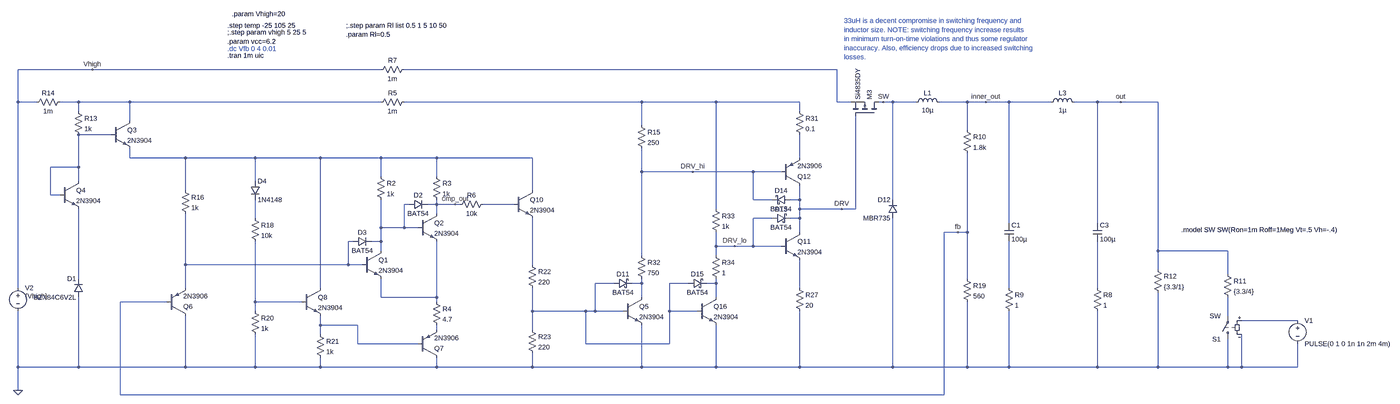
[diagram p0: schematic hyst_voltage_regulator2.asc, whole sheet]
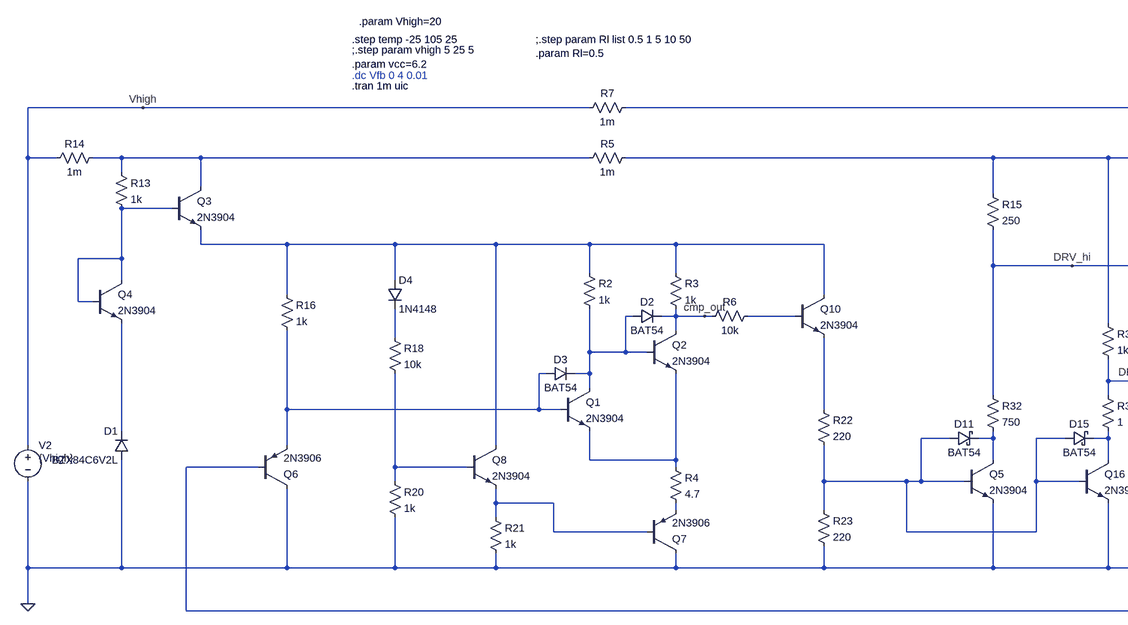
[diagram p1: schematic hyst_voltage_regulator2.asc, part, row 1 of 1, column 1 of 2]
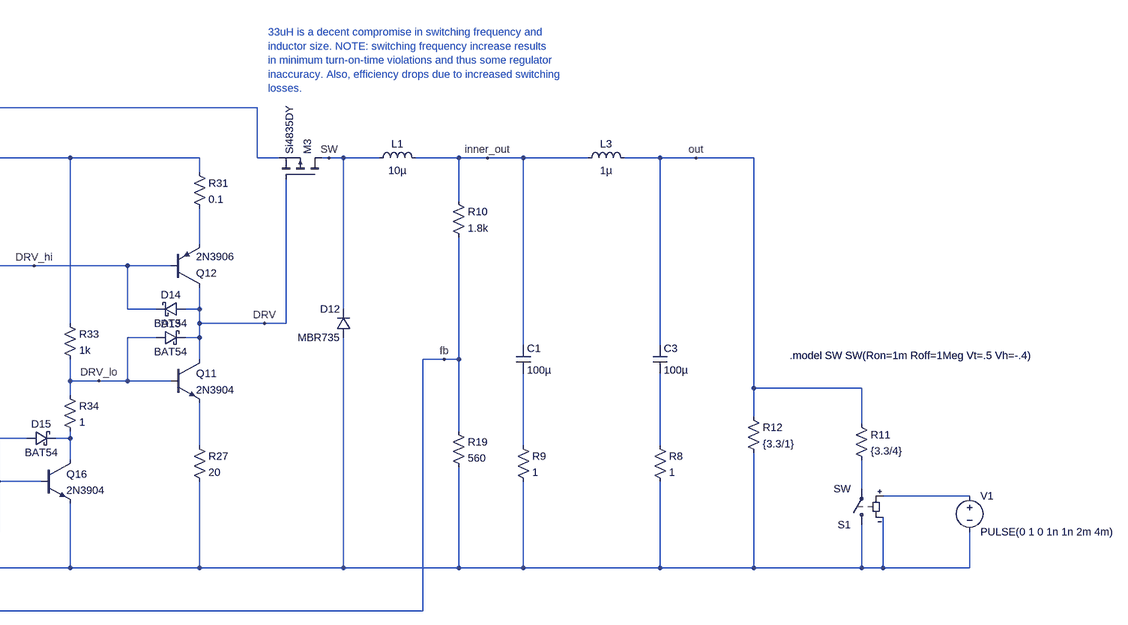
[diagram p2: schematic hyst_voltage_regulator2.asc, part, row 1 of 1, column 2 of 2]
hyst_voltage_regulator2.asc, the LTspice schematic file:
Version 4.1
SHEET 1 5252 3804
WIRE -784 -544 -1040 -544
WIRE 208 -544 -784 -544
WIRE 2000 -544 288 -544
WIRE -1040 -432 -1040 -544
WIRE -976 -432 -1040 -432
WIRE -832 -432 -896 -432
WIRE -656 -432 -832 -432
WIRE 208 -432 -656 -432
WIRE 1328 -432 288 -432
WIRE 1584 -432 1328 -432
WIRE 1872 -432 1584 -432
WIRE 2000 -432 2000 -544
WIRE 2048 -432 2000 -432
WIRE 2160 -432 2144 -432
WIRE 2192 -432 2160 -432
WIRE 2272 -432 2192 -432
WIRE 2448 -432 2352 -432
WIRE 2512 -432 2448 -432
WIRE 2592 -432 2512 -432
WIRE 2736 -432 2592 -432
WIRE 2896 -432 2816 -432
WIRE 2976 -432 2896 -432
WIRE 3104 -432 2976 -432
WIRE -832 -400 -832 -432
WIRE 1872 -400 1872 -432
WIRE -656 -368 -656 -432
WIRE 1328 -352 1328 -432
WIRE 2448 -336 2448 -432
WIRE -720 -320 -832 -320
WIRE -656 -240 -656 -272
WIRE -464 -240 -656 -240
WIRE -224 -240 -464 -240
WIRE 0 -240 -224 -240
WIRE 208 -240 0 -240
WIRE 400 -240 208 -240
WIRE 864 -240 400 -240
WIRE 1872 -240 1872 -320
WIRE -832 -208 -832 -320
WIRE -832 -208 -928 -208
WIRE 1328 -192 1328 -272
WIRE 1504 -192 1328 -192
WIRE 1712 -192 1504 -192
WIRE 1808 -192 1712 -192
WIRE 208 -176 208 -240
WIRE 400 -176 400 -240
WIRE -832 -160 -832 -208
WIRE -224 -160 -224 -240
WIRE -464 -128 -464 -240
WIRE 864 -128 864 -240
WIRE -928 -112 -928 -208
WIRE -896 -112 -928 -112
WIRE 1712 -96 1712 -192
WIRE 1776 -96 1712 -96
WIRE 1872 -96 1872 -144
WIRE 1872 -96 1840 -96
WIRE 2192 -96 2192 -432
WIRE 304 -80 288 -80
WIRE 400 -80 400 -96
WIRE 400 -80 368 -80
WIRE 464 -80 400 -80
WIRE 480 -80 464 -80
WIRE 800 -80 560 -80
WIRE 1584 -64 1584 -432
WIRE 1872 -64 1872 -96
WIRE 2016 -64 1872 -64
WIRE 2064 -64 2064 -384
WIRE 2064 -64 2016 -64
WIRE 400 -48 400 -80
WIRE -224 -32 -224 -96
WIRE 1776 -32 1712 -32
WIRE 1872 -32 1872 -64
WIRE 1872 -32 1840 -32
WIRE 2592 -16 2592 -432
WIRE 2896 -16 2896 -432
WIRE 208 0 208 -96
WIRE 288 0 288 -80
WIRE 288 0 208 0
WIRE 336 0 288 0
WIRE 1872 16 1872 -32
WIRE 2416 16 2368 16
WIRE 2448 16 2448 -256
WIRE 2448 16 2416 16
WIRE 112 48 96 48
WIRE 208 48 208 0
WIRE 208 48 176 48
WIRE 1584 64 1584 16
WIRE 1648 64 1584 64
WIRE 1712 64 1712 -32
WIRE 1712 64 1648 64
WIRE 1808 64 1712 64
WIRE 208 80 208 48
WIRE 3104 80 3104 -432
WIRE 3344 80 3104 80
WIRE 1328 96 1328 -192
WIRE 1584 96 1584 64
WIRE -464 128 -464 -48
WIRE 96 128 96 48
WIRE 96 128 -464 128
WIRE 144 128 96 128
WIRE 864 128 864 -32
WIRE 3104 144 3104 80
WIRE 3344 160 3344 80
WIRE -832 176 -832 -64
WIRE 2448 176 2448 16
WIRE 1232 192 1168 192
WIRE 1328 192 1328 176
WIRE 1328 192 1296 192
WIRE 1488 192 1424 192
WIRE 1584 192 1584 176
WIRE 1584 192 1552 192
WIRE -1040 208 -1040 -432
WIRE -464 208 -464 128
WIRE 0 208 0 -240
WIRE 1872 208 1872 112
WIRE 2592 208 2592 48
WIRE 2896 208 2896 48
WIRE 208 240 208 176
WIRE 400 240 400 48
WIRE 400 240 208 240
WIRE 1328 240 1328 192
WIRE 1584 240 1584 192
WIRE -528 256 -688 256
WIRE -224 256 -224 48
WIRE -64 256 -224 256
WIRE 400 256 400 240
WIRE -224 288 -224 256
WIRE 864 288 864 208
WIRE 1136 288 864 288
WIRE 1168 288 1168 192
WIRE 1168 288 1136 288
WIRE 1264 288 1168 288
WIRE 1424 288 1424 192
WIRE 1520 288 1424 288
WIRE 3344 304 3344 240
WIRE 3584 320 3392 320
WIRE 0 336 0 304
WIRE 128 336 0 336
WIRE 400 352 400 336
WIRE 864 352 864 288
WIRE 0 368 0 336
WIRE 128 400 128 336
WIRE 336 400 128 400
WIRE 1136 400 1136 288
WIRE 1424 400 1424 288
WIRE 1424 400 1136 400
WIRE -1040 480 -1040 288
WIRE -832 480 -832 240
WIRE -832 480 -1040 480
WIRE -464 480 -464 304
WIRE -464 480 -832 480
WIRE -224 480 -224 368
WIRE -224 480 -464 480
WIRE 0 480 0 448
WIRE 0 480 -224 480
WIRE 400 480 400 448
WIRE 400 480 0 480
WIRE 864 480 864 432
WIRE 864 480 400 480
WIRE 1328 480 1328 336
WIRE 1328 480 864 480
WIRE 1584 480 1584 336
WIRE 1584 480 1328 480
WIRE 1872 480 1872 288
WIRE 1872 480 1584 480
WIRE 2192 480 2192 -32
WIRE 2192 480 1872 480
WIRE 2448 480 2448 256
WIRE 2448 480 2192 480
WIRE 2592 480 2592 288
WIRE 2592 480 2448 480
WIRE 2896 480 2896 288
WIRE 2896 480 2592 480
WIRE 3104 480 3104 224
WIRE 3104 480 2896 480
WIRE 3344 480 3344 384
WIRE 3344 480 3104 480
WIRE 3392 480 3392 368
WIRE 3392 480 3344 480
WIRE 3584 480 3584 400
WIRE 3584 480 3392 480
WIRE -1040 560 -1040 480
WIRE -688 576 -688 256
WIRE 2368 576 2368 16
WIRE 2368 576 -688 576
FLAG -1040 560 0
FLAG 2512 -432 inner_out
FLAG 2416 16 fb
FLAG 2976 -432 out
FLAG 1504 -192 DRV_hi
FLAG 2016 -64 DRV
FLAG 2160 -432 SW
FLAG 1648 64 DRV_lo
FLAG -784 -544 Vhigh
FLAG 464 -80 cmp_out
SYMBOL npn 144 80 R0
SYMATTR InstName Q1
SYMATTR Value 2N3904
SYMBOL npn 336 -48 R0
SYMATTR InstName Q2
SYMATTR Value 2N3904
SYMBOL res 192 -192 R0
SYMATTR InstName R2
SYMATTR Value 1k
SYMBOL res 384 -192 R0
SYMATTR InstName R3
SYMATTR Value 1k
SYMBOL res 384 240 R0
SYMATTR InstName R4
SYMATTR Value 4.7
SYMBOL voltage -1040 192 R0
WINDOW 3 24 44 Left 2
WINDOW 123 0 0 Left 0
WINDOW 39 0 0 Left 0
SYMATTR Value {Vhigh}
SYMATTR InstName V2
SYMBOL res 576 -96 R90
WINDOW 0 0 56 VBottom 2
WINDOW 3 32 56 VTop 2
SYMATTR InstName R6
SYMATTR Value 10k
SYMBOL diode 304 -64 R270
WINDOW 0 32 32 VTop 2
WINDOW 3 0 32 VBottom 2
SYMATTR InstName D2
SYMATTR Value BAT54
SYMBOL diode 112 64 R270
WINDOW 0 32 32 VTop 2
WINDOW 3 0 32 VBottom 2
SYMATTR InstName D3
SYMATTR Value BAT54
SYMBOL ind 2256 -416 R270
WINDOW 0 32 56 VTop 2
WINDOW 3 4 56 VBottom 2
SYMATTR InstName L1
SYMATTR Value 10µ
SYMATTR SpiceLine Rser=1m
SYMBOL res 3328 144 R0
SYMATTR InstName R11
SYMATTR Value {3.3/4}
SYMBOL res 2432 -352 R0
SYMATTR InstName R10
SYMATTR Value 1.8k
SYMBOL res 2432 160 R0
SYMATTR InstName R19
SYMATTR Value 560
SYMBOL ind 2720 -416 R270
WINDOW 0 32 56 VTop 2
WINDOW 3 4 56 VBottom 2
SYMATTR InstName L3
SYMATTR Value 1µ
SYMATTR SpiceLine Rser=1m
SYMBOL cap 2880 -16 R0
SYMATTR InstName C3
SYMATTR Value 100µ
SYMBOL res 2880 192 R0
SYMATTR InstName R8
SYMATTR Value 1
SYMBOL npn 1264 240 R0
SYMATTR InstName Q5
SYMATTR Value 2N3904
SYMBOL schottky 1232 208 R270
WINDOW 0 32 32 VTop 2
WINDOW 3 0 32 VBottom 2
SYMATTR InstName D11
SYMATTR Value BAT54
SYMATTR Description Diode
SYMATTR Type diode
SYMBOL npn 800 -128 R0
SYMATTR InstName Q10
SYMATTR Value 2N3904
SYMBOL res 1312 -368 R0
SYMATTR InstName R15
SYMATTR Value 250
SYMBOL res 848 112 R0
SYMATTR InstName R22
SYMATTR Value 220
SYMBOL res 848 336 R0
SYMATTR InstName R23
SYMATTR Value 220
SYMBOL npn 1808 16 R0
SYMATTR InstName Q11
SYMATTR Value 2N3904
SYMBOL pnp 1808 -144 M180
SYMATTR InstName Q12
SYMATTR Value 2N3906
SYMBOL diode 2208 -32 R180
WINDOW 0 24 64 Left 2
WINDOW 3 24 0 Left 2
SYMATTR InstName D12
SYMATTR Value MBR735
SYMBOL schottky 1776 -16 R270
WINDOW 0 32 32 VTop 2
WINDOW 3 0 32 VBottom 2
SYMATTR InstName D13
SYMATTR Value BAT54
SYMATTR Description Diode
SYMATTR Type diode
SYMBOL schottky 1840 -80 M270
WINDOW 0 32 32 VTop 2
WINDOW 3 0 32 VBottom 2
SYMATTR InstName D14
SYMATTR Value BAT54
SYMATTR Description Diode
SYMATTR Type diode
SYMBOL res 1856 192 R0
SYMATTR InstName R27
SYMATTR Value 20
SYMBOL pmos 2144 -384 M270
SYMATTR InstName M3
SYMATTR Value Si4835DY
SYMBOL res 1856 -416 R0
SYMATTR InstName R31
SYMATTR Value 0.1
SYMBOL res 1312 80 R0
SYMATTR InstName R32
SYMATTR Value 750
SYMBOL npn 1520 240 R0
SYMATTR InstName Q16
SYMATTR Value 2N3904
SYMBOL schottky 1488 208 R270
WINDOW 0 32 32 VTop 2
WINDOW 3 0 32 VBottom 2
SYMATTR InstName D15
SYMATTR Value BAT54
SYMATTR Description Diode
SYMATTR Type diode
SYMBOL res 1568 -80 R0
SYMATTR InstName R33
SYMATTR Value 1k
SYMBOL res 1568 80 R0
SYMATTR InstName R34
SYMATTR Value 1
SYMBOL res 304 -448 R90
WINDOW 0 0 56 VBottom 2
WINDOW 3 32 56 VTop 2
SYMATTR InstName R5
SYMATTR Value 1m
SYMBOL res 304 -560 R90
WINDOW 0 0 56 VBottom 2
WINDOW 3 32 56 VTop 2
SYMATTR InstName R7
SYMATTR Value 1m
SYMBOL sw 3344 400 R180
SYMATTR InstName S1
SYMBOL res 3088 128 R0
SYMATTR InstName R12
SYMATTR Value {3.3/1}
SYMBOL voltage 3584 304 R0
WINDOW 123 0 0 Left 0
WINDOW 39 0 0 Left 0
SYMATTR InstName V1
SYMATTR Value PULSE(0 1 0 1n 1n 2m 4m)
SYMBOL cap 2576 -16 R0
SYMATTR InstName C1
SYMATTR Value 100µ
SYMBOL res 2576 192 R0
SYMATTR InstName R9
SYMATTR Value 1
SYMBOL diode -816 240 R180
WINDOW 0 24 64 Left 2
WINDOW 3 24 0 Left 2
SYMATTR InstName D1
SYMATTR Value BZX84C6V2L
SYMBOL res -848 -416 R0
SYMATTR InstName R13
SYMATTR Value 1k
SYMBOL npn -720 -368 R0
SYMATTR InstName Q3
SYMATTR Value 2N3904
SYMBOL npn -896 -160 R0
SYMATTR InstName Q4
SYMATTR Value 2N3904
SYMBOL res -880 -448 R90
WINDOW 0 0 56 VBottom 2
WINDOW 3 32 56 VTop 2
SYMATTR InstName R14
SYMATTR Value 1m
SYMBOL pnp -528 304 M180
SYMATTR InstName Q6
SYMATTR Value 2N3906
SYMBOL res -480 -144 R0
SYMATTR InstName R16
SYMATTR Value 1k
SYMBOL res -240 -48 R0
SYMATTR InstName R18
SYMATTR Value 10k
SYMBOL res -240 272 R0
SYMATTR InstName R20
SYMATTR Value 1k
SYMBOL pnp 336 448 M180
SYMATTR InstName Q7
SYMATTR Value 2N3906
SYMBOL npn -64 208 R0
SYMATTR InstName Q8
SYMATTR Value 2N3904
SYMBOL res -16 352 R0
SYMATTR InstName R21
SYMATTR Value 1k
SYMBOL diode -240 -160 R0
SYMATTR InstName D4
SYMATTR Value 1N4148
TEXT -320 -616 Left 2 ;.dc Vfb 0 4 0.01
TEXT -320 -672 Left 2 !;.step param vhigh 5 25 5\n.param vcc=6.2
TEXT -320 -696 Left 2 !.step temp -25 105 25
TEXT -320 -592 Left 2 !.tran 1m uic
TEXT 2024 -712 Left 2 ;33uH is a decent compromise in switching frequency and\ninductor size. NOTE: switching frequency increase results\nin minimum turn-on-time violations and thus some regulator\ninaccuracy. Also, efficiency drops due to increased switching\nlosses.
TEXT -304 -736 Left 2 !.param Vhigh=20
TEXT 88 -696 Left 2 !;.step param Rl list 0.5 1 5 10 50\n.param Rl=0.5
TEXT 3184 8 Left 2 !.model SW SW(Ron=1m Roff=1Meg Vt=.5 Vh=-.4)

The netlist it stands for:
* hyst_voltage_regulator2.asc
Q1 N007 N010 N019 0 2N3904
Q2 cmp_out N007 N019 0 2N3904
R2 N005 N007 1k
R3 N005 cmp_out 1k
R4 N019 N024 4.7
V2 Vhigh 0 {Vhigh}
R6 N008 cmp_out 10k
D2 N007 cmp_out BAT54
D3 N010 N007 BAT54
L1 SW inner_out 10µ Rser=1m
R11 out N021 {3.3/4}
R10 inner_out fb 1.8k
R19 fb 0 560
L3 inner_out out 1µ Rser=1m
C3 out N018 100µ
R8 N018 0 1
Q5 N014 N013 0 0 2N3904
D11 N013 N014 BAT54
Q10 N005 N008 N011 0 2N3904
R15 N003 DRV_hi 250
R22 N011 N013 220
R23 N013 0 220
Q11 DRV DRV_lo N016 0 2N3904
Q12 DRV DRV_hi N006 0 2N3906
D12 0 SW MBR735
D13 DRV_lo DRV BAT54
D14 DRV DRV_hi BAT54
R27 N016 0 20
M3 SW DRV N001 N001 Si4835DY
R31 N003 N006 0.1
R32 DRV_hi N014 750
Q16 N015 N013 0 0 2N3904
D15 N013 N015 BAT54
R33 N003 DRV_lo 1k
R34 DRV_lo N015 1
R5 N003 N002 1m
R7 N001 Vhigh 1m
S1 0 N021 N022 0 SW
R12 out 0 {3.3/1}
V1 N022 0 PULSE(0 1 0 1n 1n 2m 4m)
C1 inner_out N017 100µ
R9 N017 0 1
D1 0 N012 BZX84C6V2L
R13 N002 N004 1k
Q3 N002 N004 N005 0 2N3904
Q4 N004 N004 N012 0 2N3904
R14 N002 Vhigh 1m
Q6 0 fb N010 0 2N3906
R16 N005 N010 1k
R18 N009 N020 10k
R20 N020 0 1k
Q7 0 N023 N024 0 2N3906
Q8 N005 N020 N023 0 2N3904
R21 N023 0 1k
D4 N005 N009 1N4148
.model D D
.lib standard.dio
.model NPN NPN
.model PNP PNP
.lib standard.bjt
.model NMOS NMOS
.model PMOS PMOS
.lib standard.mos
* .dc Vfb 0 4 0.01
;.step param vhigh 5 25 5
.param vcc=6.2
.step temp -25 105 25
.tran 1m uic
* 33uH is a decent compromise in switching frequency and
* inductor size. NOTE: switching frequency increase results
* in minimum turn-on-time violations and thus some regulator
* inaccuracy. Also, efficiency drops due to increased switching
* losses.
.param Vhigh=20
;.step param Rl list 0.5 1 5 10 50
.param Rl=0.5
.model SW SW(Ron=1m Roff=1Meg Vt=.5 Vh=-.4)
.backanno
.end